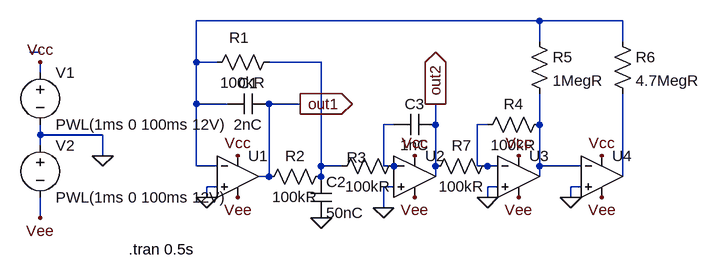
[diagram p0: schematic sloth.asc]
sloth.asc, the LTspice schematic file:
Version 4
SHEET 1 880 680
WIRE 384 -176 -144 -176
WIRE 512 -176 384 -176
WIRE 384 -144 384 -176
WIRE 512 -144 512 -176
WIRE -384 -128 -400 -128
WIRE -144 -112 -144 -176
WIRE -112 -112 -144 -112
WIRE 48 -112 -32 -112
WIRE -384 -96 -384 -112
WIRE -144 -48 -144 -112
WIRE -96 -48 -144 -48
WIRE 16 -48 -32 -48
WIRE 160 -16 144 -16
WIRE 224 -16 224 -48
WIRE 304 -16 288 -16
WIRE 384 -16 384 -64
WIRE -384 0 -384 -16
WIRE -288 0 -384 0
WIRE -384 16 -384 0
WIRE -288 32 -288 0
WIRE -144 48 -144 -48
WIRE -112 48 -144 48
WIRE 48 48 48 -112
WIRE 80 48 48 48
WIRE 144 48 144 -16
WIRE 160 48 144 48
WIRE 224 48 224 -16
WIRE 288 48 288 -16
WIRE 304 48 288 48
WIRE 320 48 304 48
WIRE 384 48 384 -16
WIRE 448 48 384 48
WIRE -32 64 -32 -48
WIRE -32 64 -48 64
WIRE 48 64 48 48
WIRE 224 64 224 48
WIRE 384 64 384 48
WIRE 512 64 512 -64
WIRE -112 80 -128 80
WIRE 160 80 144 80
WIRE 320 80 304 80
WIRE 448 80 432 80
WIRE -128 96 -128 80
WIRE 304 96 304 80
WIRE 432 96 432 80
WIRE 144 112 144 80
WIRE -384 128 -384 96
FLAG -288 32 0
FLAG -384 -112 Vcc
FLAG -384 128 Vee
FLAG -128 96 0
FLAG 144 112 0
FLAG 304 96 0
FLAG 432 96 0
FLAG 48 128 0
FLAG 16 -48 out1
IOPIN 16 -48 Out
FLAG 224 -48 out2
IOPIN 224 -48 Out
FLAG -80 32 Vcc
FLAG 192 32 Vcc
FLAG 352 32 Vcc
FLAG 480 32 Vcc
FLAG -80 96 Vee
FLAG 192 96 Vee
FLAG 352 96 Vee
FLAG 480 96 Vee
SYMBOL voltage -384 0 R0
WINDOW 123 0 0 Left 0
WINDOW 39 0 0 Left 0
SYMATTR InstName V2
SYMATTR Value PWL(1ms 0 100ms 12V)
SYMBOL Opamps\\UniversalOpamp2 -80 64 R0
SYMATTR InstName U1
SYMATTR SpiceLine ilimit=25m rail=0 Vos=0.1µ phimargin=45
SYMBOL Opamps\\UniversalOpamp2 192 64 R0
SYMATTR InstName U2
SYMATTR SpiceLine ilimit=25m rail=0 Vos=0.1µ phimargin=45
SYMBOL Opamps\\UniversalOpamp2 352 64 R0
SYMATTR InstName U3
SYMATTR SpiceLine ilimit=25m rail=0 Vos=0.1µ phimargin=45
SYMBOL Opamps\\UniversalOpamp2 480 64 R0
SYMATTR InstName U4
SYMATTR SpiceLine ilimit=25m rail=0 Vos=0.1µ phimargin=45
SYMBOL res -16 -128 R90
WINDOW 0 -6 62 VBottom 2
WINDOW 3 32 56 VTop 2
SYMATTR InstName R1
SYMATTR Value 100kR
SYMBOL res 64 48 R90
WINDOW 0 0 56 VBottom 2
WINDOW 3 32 56 VTop 2
SYMATTR InstName R2
SYMATTR Value 100kR
SYMBOL cap -32 -64 R90
WINDOW 0 0 32 VBottom 2
WINDOW 3 32 32 VTop 2
SYMATTR InstName C1
SYMATTR Value 2nC
SYMBOL cap 32 64 R0
SYMATTR InstName C2
SYMATTR Value 50nC
SYMBOL res 176 32 R90
WINDOW 0 18 73 VBottom 2
WINDOW 3 32 56 VTop 2
SYMATTR InstName R3
SYMATTR Value 100kR
SYMBOL cap 224 -32 R90
WINDOW 0 0 32 VBottom 2
WINDOW 3 32 32 VTop 2
SYMATTR InstName C3
SYMATTR Value 1nC
SYMBOL res 400 -32 R90
WINDOW 0 0 56 VBottom 2
WINDOW 3 32 56 VTop 2
SYMATTR InstName R4
SYMATTR Value 100kR
SYMBOL res 368 -160 R0
SYMATTR InstName R5
SYMATTR Value 1MegR
SYMBOL res 496 -160 R0
SYMATTR InstName R6
SYMATTR Value 4.7MegR
SYMBOL voltage -384 -112 R0
WINDOW 123 0 0 Left 0
WINDOW 39 0 0 Left 0
SYMATTR InstName V1
SYMATTR Value PWL(1ms 0 100ms 12V)
SYMBOL res 320 32 R90
WINDOW 0 0 56 VBottom 2
WINDOW 3 32 56 VTop 2
SYMATTR InstName R7
SYMATTR Value 100kR
TEXT -248 176 Left 2 !.tran 0.5s

The netlist it stands for:
* sloth.asc
V2 0 Vee PWL(1ms 0 100ms 12V)
XU1 0 N001 Vcc Vee out1 level.2 Avol=1Meg GBW=10Meg Slew=10Meg ilimit=25m rail=0 Vos=0.1µ phimargin=45 en=0 enk=0 in=0 ink=0 Rin=500Meg  ; pins IN+ IN- V+ V- OUT
XU2 0 N004 Vcc Vee out2 level.2 Avol=1Meg GBW=10Meg Slew=10Meg ilimit=25m rail=0 Vos=0.1µ phimargin=45 en=0 enk=0 in=0 ink=0 Rin=500Meg  ; pins IN+ IN- V+ V- OUT
XU3 0 N005 Vcc Vee N006 level.2 Avol=1Meg GBW=10Meg Slew=10Meg ilimit=25m rail=0 Vos=0.1µ phimargin=45 en=0 enk=0 in=0 ink=0 Rin=500Meg  ; pins IN+ IN- V+ V- OUT
XU4 0 N006 Vcc Vee N007 level.2 Avol=1Meg GBW=10Meg Slew=10Meg ilimit=25m rail=0 Vos=0.1µ phimargin=45 en=0 enk=0 in=0 ink=0 Rin=500Meg  ; pins IN+ IN- V+ V- OUT
R1 N003 N001 100kR
R2 N003 out1 100kR
C1 out1 N001 2nC
C2 N003 0 50nC
R3 N004 N003 100kR
C3 out2 N004 1nC
R4 N006 N005 100kR
R5 N001 N006 1MegR
R6 N001 N007 4.7MegR
V1 Vcc 0 PWL(1ms 0 100ms 12V)
R7 N005 out2 100kR
.tran 0.5s
.lib UniversalOpamps2.sub
.backanno
.end